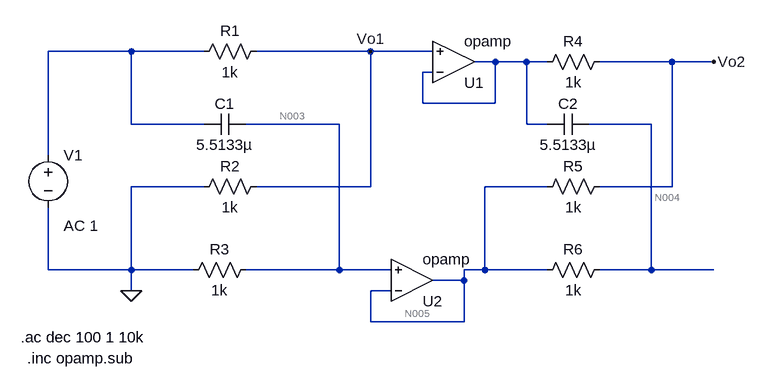
[diagram p0: schematic ej7_prueba1orden_lattice.asc]
ej7_prueba1orden_lattice.asc, the LTspice schematic file:
Version 4
SHEET 1 956 680
WIRE 0 -64 -128 -64
WIRE 112 -64 0 -64
WIRE 368 -64 192 -64
WIRE 464 -64 368 -64
WIRE 560 -48 528 -48
WIRE 608 -48 560 -48
WIRE 640 -48 608 -48
WIRE 832 -48 720 -48
WIRE 896 -48 832 -48
WIRE 464 -32 448 -32
WIRE 448 16 448 -32
WIRE 560 16 560 -48
WIRE 560 16 448 16
WIRE 0 48 0 -64
WIRE 112 48 0 48
WIRE 320 48 176 48
WIRE 608 48 608 -48
WIRE 640 48 608 48
WIRE 800 48 704 48
WIRE -128 96 -128 -64
WIRE 112 144 0 144
WIRE 368 144 368 -64
WIRE 368 144 192 144
WIRE 640 144 544 144
WIRE 832 144 832 -48
WIRE 832 144 720 144
WIRE -128 272 -128 176
WIRE 0 272 0 144
WIRE 0 272 -128 272
WIRE 96 272 0 272
WIRE 320 272 320 48
WIRE 320 272 176 272
WIRE 400 272 320 272
WIRE 544 272 544 144
WIRE 544 272 512 272
WIRE 640 272 544 272
WIRE 800 272 800 48
WIRE 800 272 720 272
WIRE 896 272 800 272
WIRE 512 288 512 272
WIRE 512 288 464 288
WIRE 0 304 0 272
WIRE 400 304 368 304
WIRE 368 352 368 304
WIRE 512 352 512 288
WIRE 512 352 368 352
FLAG 0 304 0
FLAG 368 -64 Vo1
FLAG 896 -48 Vo2
SYMBOL voltage -128 80 R0
WINDOW 123 24 124 Left 2
WINDOW 39 0 0 Left 0
SYMATTR InstName V1
SYMATTR Value ""
SYMATTR Value2 AC 1
SYMBOL res 208 -80 R90
WINDOW 0 0 56 VBottom 2
WINDOW 3 32 56 VTop 2
SYMATTR InstName R1
SYMATTR Value 1k
SYMBOL cap 176 32 R90
WINDOW 0 0 32 VBottom 2
WINDOW 3 32 32 VTop 2
SYMATTR InstName C1
SYMATTR Value 5.5133µ
SYMBOL res 208 128 R90
WINDOW 0 0 56 VBottom 2
WINDOW 3 32 56 VTop 2
SYMATTR InstName R2
SYMATTR Value 1k
SYMBOL res 192 256 R90
WINDOW 0 0 56 VBottom 2
WINDOW 3 32 56 VTop 2
SYMATTR InstName R3
SYMATTR Value 1k
SYMBOL OpAmps\\opamp 496 16 M180
SYMATTR InstName U1
SYMBOL res 736 -64 R90
WINDOW 0 0 56 VBottom 2
WINDOW 3 32 56 VTop 2
SYMATTR InstName R4
SYMATTR Value 1k
SYMBOL res 736 128 R90
WINDOW 0 0 56 VBottom 2
WINDOW 3 32 56 VTop 2
SYMATTR InstName R5
SYMATTR Value 1k
SYMBOL res 736 256 R90
WINDOW 0 0 56 VBottom 2
WINDOW 3 32 56 VTop 2
SYMATTR InstName R6
SYMATTR Value 1k
SYMBOL cap 704 32 R90
WINDOW 0 0 32 VBottom 2
WINDOW 3 32 32 VTop 2
SYMATTR InstName C2
SYMATTR Value 5.5133µ
SYMBOL OpAmps\\opamp 432 352 M180
SYMATTR InstName U2
TEXT -170 376 Left 2 !.ac dec 100 1 10k
TEXT -160 408 Left 2 !.inc opamp.sub

The netlist it stands for:
* ej7_prueba1orden_lattice.asc
V1 N001 0 AC 1
R1 Vo1 N001 1k
C1 N003 N001 5.5133µ
R2 Vo1 0 1k
R3 N003 0 1k
XU1 N002 Vo1 N002 opamp Aol=100K GBW=10Meg  ; pins invin noninvin out
R4 Vo2 N002 1k
R5 Vo2 N005 1k
R6 N004 N005 1k
C2 N004 N002 5.5133µ
XU2 N005 N003 N005 opamp Aol=100K GBW=10Meg  ; pins invin noninvin out
.ac dec 100 1 10k
.inc opamp.sub
.backanno
.end

* Results of the author's LTspice run, read from the files saved beside the schematic
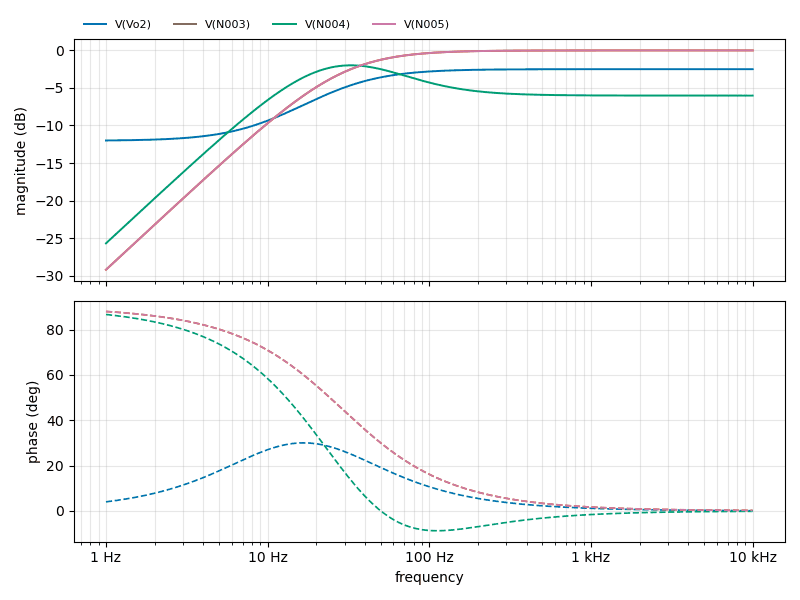
[diagram p1: AC Analysis of ej7_prueba1orden_lattice.asc, plotted from the saved traces]
* AC Analysis, 1 run:
*   V(Vo2): -12.00 dB at 1 Hz, -2.50 dB at 10 kHz, peak -2.50 dB at 10 kHz, 3 dB below the peak at 25.46 Hz
*   V(N003): -29.21 dB at 1 Hz, -0.00 dB at 10 kHz, peak -0.00 dB at 10 kHz, 3 dB below the peak at 28.87 Hz
*   V(N004): -25.70 dB at 1 Hz, -6.02 dB at 10 kHz, peak -1.99 dB at 32.36 Hz, 3 dB below the peak at 12.82 Hz and 141.9 Hz
*   V(N005): -29.21 dB at 1 Hz, -0.00 dB at 10 kHz, peak -0.00 dB at 10 kHz, 3 dB below the peak at 28.87 Hz